# Altium schematic sheet BQ25570.SchDoc: LPEDT_Project_Schematic (part 2 of 3)
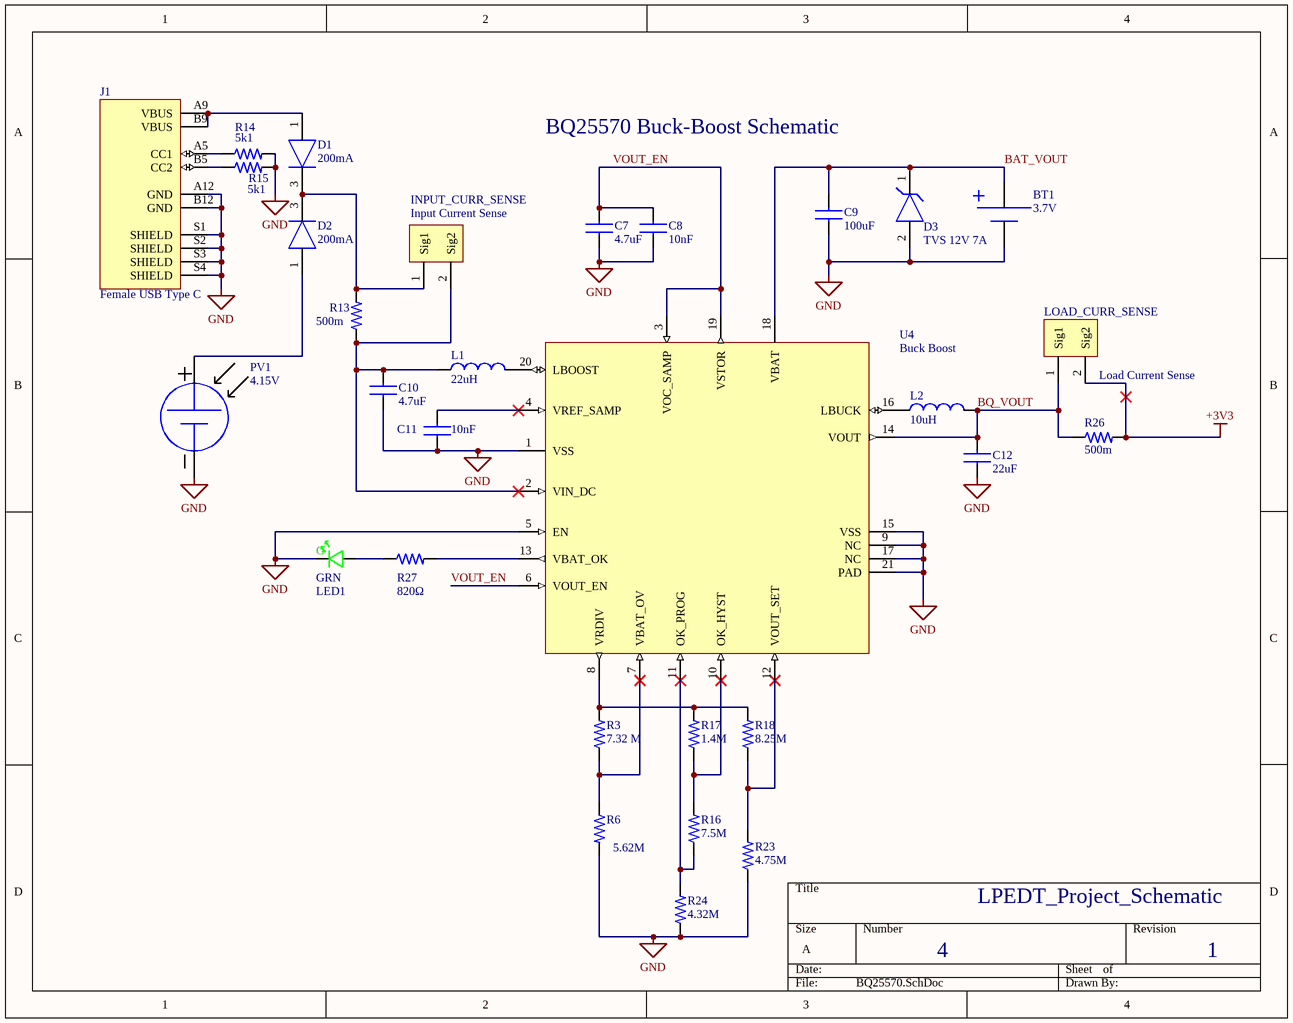
[diagram p1: BQ25570.SchDoc]
## Library data of the parts
BT1 = BT_CoinCell_25.4mm: BATTERY HOLDER COIN 24.5MM SMD; Manufacturer: Memory Protection Devices; Manufacturer Part Number: BU2450SM-JJ-GTR; Supplier: Digikey; Supplier Part Number: BU2450SM-JJ-GCT-ND; RoHS: Yes; Category: Uncategorized; Stock: 49410; Pricing: 1=1.72, 10=1.445, 50=1.2702, 100=1.1967 (USD); ComponentLink1URL: https://datasheet.ciiva.com/4/bu2450sm-jj-gtr-datasheet-4338.pdf?src-supplier=Digikey; ComponentLink1Description: https://datasheet.ciiva.com/4/bu2450sm-jj-gtr-datasheet-4338.pdf?src-supplier=Digikey; ComponentLink2URL: https://datasheet.ciiva.com/4/bu2450sm-jj-gtr-datasheet-4339.pdf?src-supplier=Digikey; ComponentLink2Description: https://datasheet.ciiva.com/4/bu2450sm-jj-gtr-datasheet-4339.pdf?src-supplier=Digikey; ComponentLink3URL: https://datasheet.ciiva.com/4/bu2450sm-jj-gtr-datasheet-4340.pdf?src-supplier=Digikey; ComponentLink3Description: https://datasheet.ciiva.com/4/bu2450sm-jj-gtr-datasheet-4340.pdf?src-supplier=Digikey
C7 C10 = C_4.7U_0603: CAP CER 4.7UF 10V X5R 0603; Manufacturer: Murata; Manufacturer Part Number: GRM188R61A475KAAJD; Dielectric Material: Ceramic; Multilayer: Yes; Tolerance  (fill in as +-): 10%; Supplier: Digikey; Supplier Part Number: 490-14373-1-ND; RoHS: Yes; Category: Ceramic Capacitors; Stock: 53982; Pricing: 1=0.38, 10=0.251, 50=0.185, 100=0.1506, 500=0.11888, 1000=0.10039 (USD); Mounting Technology: Surface Mount; Pins: 2; Package Shape: Rectangular; Case/Package: 0603; Terminal Finish: Nickel; Min Operating Temperature: -55°C; Max Operating Temperature: 85°C; JESD-609 Code: e3; Value: 4.7uF; Capacitor Type: Ceramic; Packaging: Tape and Reel; Tolerance (fill in as +-): 10%; Rated DC Voltage (URdc): 10V; Temperature Characteristics Code: X5R; Termination: Wraparound; Reach SVHC Compliant: Yes; RoHS Compliant: Yes; ComponentLink1URL: https://datasheet.ciiva.com:443/pdfs/VipMasterIC/IC/MURE/MURE-S-A0004349797/MURE-S-A0004352595-1.pdf?src-supplier=IHS+Markit; ComponentLink1Description: https://datasheet.ciiva.com:443/pdfs/VipMasterIC/IC/MURE/MURE-S-A0004349797/MURE-S-A0004352595-1.pdf?src-supplier=IHS+Markit; ComponentLink2URL: http://search.murata.co.jp/Ceramy/image/img/A01X/G101/ENG/GRM188R61A475KAAJ-01.pdf?src-supplier=Digikey; ComponentLink2Description: http://search.murata.co.jp/Ceramy/image/img/A01X/G101/ENG/GRM188R61A475KAAJ-01.pdf?src-supplier=Digikey
C8 C11 = C_10N_0603: Ceramic Capacitor, Multilayer, Ceramic, 100V, 10% +Tol, 10% -Tol, X7R, 15% TC, 0.01uF, Surface Mount, 0603; Manufacturer: Murata; Manufacturer Part Number: GCM188R72A103KA37D; Multilayer: Yes; Reference Standard: AEC-Q200; Supplier: Digikey; Supplier Part Number: 490-4781-6-ND; RoHS: Yes; Category: Ceramic Capacitors; Stock: 7901608; Pricing: 1=0.1, 10=0.038, 50=0.0218, 100=0.0168, 500=0.01268, 1000=0.00996 (USD); Mounting Technology: Surface Mount; Pins: 2; Dielectric Material: Ceramic; Package Shape: Rectangular; Case/Package: 0603; Terminal Finish: Nickel; Min Operating Temperature: -55°C; Max Operating Temperature: 125°C; JESD-609 Code: e3; Value: 10nF; Capacitor Type: Ceramic; Tolerance  (fill in as +-): 10%; Package Style: SMTMeter; Packaging: Tape and Reel; Tolerance (fill in as +-): 10%; Rated DC Voltage (URdc): 100V; Temperature Characteristics Code: X7R; Termination: Wraparound; Length: 1.6mm; Width: 0.8mm; Height: 0.9mm; Reach SVHC Compliant: Yes; RoHS Compliant: Yes; ComponentLink1URL: https://psearch.en.murata.com:443/capacitor/product/GCM188R72A103KA37%23.pdf?src-supplier=IHS+Markit; ComponentLink1Description: https://psearch.en.murata.com:443/capacitor/product/GCM188R72A103KA37%23.pdf?src-supplier=IHS+Markit; ComponentLink2URL: https://datasheet.ciiva.com/132/product-132908.pdf?src-supplier=Digikey; ComponentLink2Description: https://datasheet.ciiva.com/132/product-132908.pdf?src-supplier=Digikey; ComponentLink3URL: https://datasheet.ciiva.com/132/product-132907.pdf?src-supplier=Digikey; ComponentLink3Description: https://datasheet.ciiva.com/132/product-132907.pdf?src-supplier=Digikey; ComponentLink4URL: https://datasheet.ciiva.com/132/product-132909.pdf?src-supplier=Digikey; ComponentLink4Description: https://datasheet.ciiva.com/132/product-132909.pdf?src-supplier=Digikey; ComponentLink5URL: https://datasheet.ciiva.com/11786/0900766b80ef92d0-11786108.pdf?src-supplier=Rs; ComponentLink5Description: https://datasheet.ciiva.com/11786/0900766b80ef92d0-11786108.pdf?src-supplier=Rs; ComponentLink6URL: https://datasheet.ciiva.com/16497/product-16497251.pdf?src-supplier=Future+Electronics; ComponentLink6Description: https://datasheet.ciiva.com/16497/product-16497251.pdf?src-supplier=Future+Electronics; ComponentLink7URL: https://datasheet.ciiva.com/18183/getdatasheetpartid-178890-18183651.pdf?src-supplier=Verical; ComponentLink7Description: https://datasheet.ciiva.com/18183/getdatasheetpartid-178890-18183651.pdf?src-supplier=Verical; ComponentLink8URL: https://datasheet.ciiva.com/11619/product-11619719.pdf?src-supplier=Avnet; ComponentLink8Description: https://datasheet.ciiva.com/11619/product-11619719.pdf?src-supplier=Avnet
C9 = C_100U_0805: CAP CER 100UF 6.3V X5R 0805; Manufacturer: Murata; Manufacturer Part Number: GRM21BR60J107ME15L; Dielectric Material: Ceramic; Multilayer: Yes; Tolerance  (fill in as +-): 20%; Supplier: Digikey; Supplier Part Number: 490-13981-1-ND; RoHS: Yes; Category: Ceramic Capacitors; Stock: 216821; Pricing: 1=1.15, 10=0.863, 50=0.7874, 100=0.645, 500=0.5148, 1000=0.45423 (USD); Mounting Technology: Surface Mount; Pins: 2; Package Shape: Rectangular; Case/Package: 0805; Terminal Finish: Nickel; Min Operating Temperature: -55°C; Max Operating Temperature: 85°C; JESD-609 Code: e3; Value: 100uF; Capacitor Type: Ceramic; Packaging: Tape and Reel; Tolerance (fill in as +-): 20%; Rated DC Voltage (URdc): 6.3V; Temperature Characteristics Code: X5R; Termination: Wraparound; Reach SVHC Compliant: Yes; RoHS Compliant: Yes; ComponentLink1URL: https://datasheet.ciiva.com:443/pdfs/VipMasterIC/IC/MURE/MURE-S-A0004349797/MURE-S-A0004361963-1.pdf?src-supplier=IHS+Markit; ComponentLink1Description: https://datasheet.ciiva.com:443/pdfs/VipMasterIC/IC/MURE/MURE-S-A0004349797/MURE-S-A0004361963-1.pdf?src-supplier=IHS+Markit; ComponentLink2URL: http://www.farnell.com/datasheets/1957830.pdf?src-supplier=Farnell; ComponentLink2Description: http://www.farnell.com/datasheets/1957830.pdf?src-supplier=Farnell; ComponentLink3URL: https://datasheet.octopart.com/GRM21BR60J107ME15L-Murata-datasheet-48012791.pdf?src-supplier=Element14; ComponentLink3Description: https://datasheet.octopart.com/GRM21BR60J107ME15L-Murata-datasheet-48012791.pdf?src-supplier=Element14; ComponentLink4URL: http://www.farnell.com/datasheets/1957830.pdf?src-supplier=Element14; ComponentLink4Description: http://www.farnell.com/datasheets/1957830.pdf?src-supplier=Element14; ComponentLink5URL: https://search.murata.co.jp/Ceramy/image/img/A01X/G101/ENG/GRM21BR60J107ME15-01.pdf?src-supplier=Digikey; ComponentLink5Description: https://search.murata.co.jp/Ceramy/image/img/A01X/G101/ENG/GRM21BR60J107ME15-01.pdf?src-supplier=Digikey; ComponentLink6URL: https://datasheet.octopart.com/GRM21BR60J107ME15L-Murata-datasheet-62287462.pdf?src-supplier=Future+Electronics; ComponentLink6Description: https://datasheet.octopart.com/GRM21BR60J107ME15L-Murata-datasheet-62287462.pdf?src-supplier=Future+Electronics; ComponentLink7URL: http://www.farnell.com/datasheets/1957830.pdf?src-supplier=Newark; ComponentLink7Description: http://www.farnell.com/datasheets/1957830.pdf?src-supplier=Newark; ComponentLink8URL: https://datasheet.octopart.com/GRM21BR60J107ME15L-Murata-datasheet-165579666.pdf?src-supplier=TME; ComponentLink8Description: https://datasheet.octopart.com/GRM21BR60J107ME15L-Murata-datasheet-165579666.pdf?src-supplier=TME
C12 = C_22U_0603: CAP CER 22UF 10V X5R 0603; Manufacturer: Murata; Manufacturer Part Number: GRM188R61A226ME15D; Voltage Rating DC: 10 VDC; Tolerance: 20 %; Brand: Murata Electronics; Type: Voltage and Temperature Derating Recommended Product; Unit Weight: 0.000222 oz; Supplier 1: Digi-Key; Supplier Part Number 1: 490-10476-1-ND; Stock 1: 849458; Pricing 1: 1=0.33, 10=0.226, 50=0.1506, 100=0.1279, 500=0.0903, 1000=0.079 (USD); Product Category: Multilayer Ceramic Capacitors MLCC - SMD/SMT; RoHS: True; Capacitance: 22 uF; Dielectric: X5R; Case Code - in: 0603; Case Code - mm: 1608; Height: 0.8 mm; Maximum Operating Temperature: + 85 C; Minimum Operating Temperature: - 55 C; Product: General Type MLCCs; Series: GRM; Packaging: Reel; Length: 1.6 mm; Package / Case: 0603 (1608 metric); Factory Pack Quantity: 4000; Termination Style: SMD/SMT; Width: 0.8 mm; ComponentLink1URL: http://www.farnell.com/datasheets/2047978.pdf?src-supplier=Element14; ComponentLink1Description: http://www.farnell.com/datasheets/2047978.pdf?src-supplier=Element14
D1 D2 = D_200m: Rectifier Diode, Schottky, 1 Phase, 1 Element, 0.2A, 30V V(RRM), Silicon, TO-236; Manufacturer: ON Semiconductor; Manufacturer Part Number: BAT54LT1G; Package Body Material: Plastic; Forward Voltage: 1V; Number of Elements: 1; Max Power Dissipation: 200mW; Reverse Recovery Time-Max: 0.005us; Time @ Peak Reflow Temperature-Max (s): 40s; Qualification Status: Not Qualified; Supplier: Digikey; Supplier Part Number: BAT54LT1GOSCT-ND; RoHS: Yes; Category: Schottky Diodes; Stock: 189870; Pricing: 1=0.13, 10=0.095, 100=0.0511, 500=0.04014, 1000=0.02788 (USD); Pins: 3; Diode Element Material: SILICON; Package Shape: Rectangular; Terminal Finish: Tin; Min Operating Temperature: -55°C; Max Operating Temperature: 125°C; Diode Type: RECTIFIER; JESD-30 Code: R-PDSO-G3; Max Output current: 200mA; Package Style: SMALL OUTLINEMeter; Rep Pk Reverse Voltage-Max: 30V; Surface Mount: Yes; Technology: SCHOTTKY; Terminal Form: Gull Wing; Terminal Position: DUAL; JESD-609 Code: e3; Moisture Sensitivity Level: 1; Peak Reflow Temperature (Cel): 260°C; Reach SVHC Compliant: Yes; RoHS Compliant: Yes; JEDEC-95 Code: TO-236; ComponentLink1URL: https://datasheet.ciiva.com:443/pdfs/VipMasterIC/IC/ONSM/ONSM-S-A0005932371/ONSM-S-A0005932371-1.pdf?src-supplier=IHS+Markit; ComponentLink1Description: https://datasheet.ciiva.com:443/pdfs/VipMasterIC/IC/ONSM/ONSM-S-A0005932371/ONSM-S-A0005932371-1.pdf?src-supplier=IHS+Markit; ComponentLink2URL: https://datasheet.ciiva.com/7962/bat54lt1-d-7962967.pdf?src-supplier=Element14; ComponentLink2Description: https://datasheet.ciiva.com/7962/bat54lt1-d-7962967.pdf?src-supplier=Element14; ComponentLink3URL: https://datasheet.ciiva.com/8299/bat54lt1-d-8299649.pdf?src-supplier=Avnet; ComponentLink3Description: https://datasheet.ciiva.com/8299/bat54lt1-d-8299649.pdf?src-supplier=Avnet; ComponentLink4URL: https://datasheet.ciiva.com/1180/bat54lt1-d-1180300.pdf?src-supplier=Element14; ComponentLink4Description: https://datasheet.ciiva.com/1180/bat54lt1-d-1180300.pdf?src-supplier=Element14; ComponentLink5URL: https://datasheet.ciiva.com/1180/bat54lt1-d-1180299.pdf?src-supplier=Element14; ComponentLink5Description: https://datasheet.ciiva.com/1180/bat54lt1-d-1180299.pdf?src-supplier=Element14; ComponentLink6URL: https://datasheet.ciiva.com/28381/bat54lt1-d-28381274.pdf?src-supplier=Element14; ComponentLink6Description: https://datasheet.ciiva.com/28381/bat54lt1-d-28381274.pdf?src-supplier=Element14; ComponentLink7URL: https://datasheet.ciiva.com/14559/70099483-14559786.pdf?src-supplier=Allied+Electronics; ComponentLink7Description: https://datasheet.ciiva.com/14559/70099483-14559786.pdf?src-supplier=Allied+Electronics; ComponentLink8URL: https://datasheet.ciiva.com/8299/bat54lt1-d-8299979.pdf?src-supplier=Avnet; ComponentLink8Description: https://datasheet.ciiva.com/8299/bat54lt1-d-8299979.pdf?src-supplier=Avnet; ComponentLink9URL: https://datasheet.ciiva.com/16421/bat54lt1-d-16421631.pdf?src-supplier=Future+Electronics; ComponentLink9Description: https://datasheet.ciiva.com/16421/bat54lt1-d-16421631.pdf?src-supplier=Future+Electronics; ComponentLink10URL: https://datasheet.ciiva.com/915/bat54lt1-d-915396.pdf?src-supplier=Digikey; ComponentLink10Description: https://datasheet.ciiva.com/915/bat54lt1-d-915396.pdf?src-supplier=Digikey; ComponentLink11URL: https://datasheet.ciiva.com/915/bat54lt1-d-915397.pdf?src-supplier=Digikey; ComponentLink11Description: https://datasheet.ciiva.com/915/bat54lt1-d-915397.pdf?src-supplier=Digikey; ComponentLink12URL: https://datasheet.ciiva.com/915/bat54lt1-d-915395.pdf?src-supplier=Digikey; ComponentLink12Description: https://datasheet.ciiva.com/915/bat54lt1-d-915395.pdf?src-supplier=Digikey
D3 = D_TVS_7A: TVS DIODE 5VWM 12VC SOD723; Manufacturer: Littelfuse; Manufacturer Part Number: SP1003-01DTG; Direction: Unidirectional; Reverse Breakdown Voltage: 6V; Operating Supply Voltage: 5V; Value: 30pF; Number of Channels: 1; Power Line Protection: No; Polarity: Bidirectional,Unidirectional; Test Current: 1mA; Leakage Current: 100nA; Diode Type: ZENER; Clamping Voltage-Max: 12.5V; Supplier: Digikey; Supplier Part Number: F3377CT-ND; RoHS: Yes; Category: TVS Diodes; Stock: 109631; Pricing: 1=0.53, 10=0.41, 100=0.2459, 500=0.22772, 1000=0.15485, 2000=0.14255 (USD); Mounting Technology: Surface Mount; Pins: 2; Min Operating Temperature: -40°C; Max Operating Temperature: 85°C; Packaging: Tape and Reel; Package Quantity: 8000; Max Surge Current: 7A; Number of Unidirectional Channels: 1; Reverse Standoff Voltage: 5V; Min Breakdown Voltage: 6V; Clamping Voltage: 12V; Breakdown Voltage: 5V; Termination: SMD/SMT; Number of Elements: 1; Peak Pulse Current: 7A; Series: SP1003, SPA®; Reach SVHC Compliant: No; Lead Free: Lead Free; RoHS Compliant: Yes; ComponentLink1URL: https://datasheet.ciiva.com/8062/littelfuse-spa-sp1003-series-8062432.pdf?src-supplier=Element14; ComponentLink1Description: https://datasheet.ciiva.com/8062/littelfuse-spa-sp1003-series-8062432.pdf?src-supplier=Element14; ComponentLink2URL: https://datasheet.ciiva.com/5771/littelfuse-spa-sp1003-series-5771141.pdf?src-supplier=Farnell; ComponentLink2Description: https://datasheet.ciiva.com/5771/littelfuse-spa-sp1003-series-5771141.pdf?src-supplier=Farnell; ComponentLink3URL: https://datasheet.ciiva.com/330/littelfuse-tvs-diode-array-sp1003-datasheet-pdf-330691.pdf?src-supplier=Digikey; ComponentLink3Description: https://datasheet.ciiva.com/330/littelfuse-tvs-diode-array-sp1003-datasheet-pdf-330691.pdf?src-supplier=Digikey; ComponentLink4URL: https://datasheet.ciiva.com/330/littelfuse-tvs-diode-array-sp1003-datasheet-pdf-330692.pdf?src-supplier=Digikey; ComponentLink4Description: https://datasheet.ciiva.com/330/littelfuse-tvs-diode-array-sp1003-datasheet-pdf-330692.pdf?src-supplier=Digikey; ComponentLink5URL: https://datasheet.ciiva.com/330/littelfuse-tvs-diode-array-sp1003-datasheet-pdf-330693.pdf?src-supplier=Digikey; ComponentLink5Description: https://datasheet.ciiva.com/330/littelfuse-tvs-diode-array-sp1003-datasheet-pdf-330693.pdf?src-supplier=Digikey
INPUT_CURR_SENSE LOAD_CURR_SENSE = TP_2PIN_MALE: Board Connector, 2 Contact(s), 1 Row(s), Male, Straight, 0.1 inch Pitch, Solder Terminal, Locking, Black Insulator, Plug; Manufacturer: Wurth Electronics; Manufacturer Part Number: 61300211121; Option: General Purpose; Contact Pattern: RECTANGULAR; Contact Resistance: 20mR; Contact Style: SQ PIN-SKT; Dielectric Withstanding Voltage (AC): 500V; Filter Feature: No; Insulation Resistance: 1GR; Number Of Connectors: 1; Rated Current (Signal): 3A; Number of Contacts: 2; Body Length: 0.2inch; Reference Standard: UL; Reliability: COMMERCIAL; Supplier: Digikey; Supplier Part Number: 732-5315-ND; RoHS: Yes; Category: Headers and Wire Housings; Stock: 151065; Pricing: 1=0.13, 10=0.113, 25=0.094, 50=0.079, 100=0.071, 1000=0.065 (USD); Mounting Technology: Board; Contact Material: Copper Alloy; Contact Finish - Mating: GOLD; Contact Finish - Termination: Gold (Au) - with Nickel (Ni) barrier; Insulation Color: Black; Insulation Material: Polybutylene; Min Operating Temperature: -40°C; Max Operating Temperature: 125°C; Connector Type: BOARD CONNECTOR; JESD-609 Code: e4; Body/Shell Style: PLUG; Contact Gender: Male; Mixed Contacts: No; Mounting Style: STRAIGHT; Number of Rows Loaded: 1; PCB Contact Pattern: RECTANGULAR; Termination: Solder; Body Breadth: 0.1inch; Body Depth: 0.1inch; Mating Contact Pitch: 0.1inch; Mounting Option 1: LOCKING; Terminal Length: 0.118inch; Terminal Pitch: 2.54mm; Flammability Rating: UL94 V-0; Reach SVHC Compliant: Yes; RoHS Compliant: Yes; DIN Conformance: No; IEC Conformance: No; MIL Conformance: No; ComponentLink1URL: https://datasheet.ciiva.com:443/pdfs/VipMasterIC/IC/MIDC/MIDCS07676/MIDCS07676-1.pdf?src-supplier=IHS+Markit; ComponentLink1Description: https://datasheet.ciiva.com:443/pdfs/VipMasterIC/IC/MIDC/MIDCS07676/MIDCS07676-1.pdf?src-supplier=IHS+Markit; ComponentLink2URL: https://datasheet.ciiva.com/13619/6130xx11121-48870-13619345.pdf?src-supplier=Mouser; ComponentLink2Description: https://datasheet.ciiva.com/13619/6130xx11121-48870-13619345.pdf?src-supplier=Mouser
J1 = USB-C Power Connector: USB-C (USB TYPE-C) Receptacle Connector 24 (6+18 Dummy) Position Surface Mount, Right Angle; Through Hole; Manufacturer Part Number: USB4125-GF-A_REVA2; Package: None; Availability: Unavailable; Value: *; Price: None
L1 = L_22U_2828: General Purpose Inductor, 22uH, 20%, 1 Element, Ferrite-Core, SMD, 1111; Manufacturer: Wurth Electronics; Manufacturer Part Number: 744025220; Case/Size Code: 1111; DC Resistance (DCR): 575mR; Inductor Application: RF INDUCTOR; Channels: 1; Max Current Rating: 500mA; Self Resonant Frequency: 23MHz; Shape/Size Description: RECTANGULAR PACKAGE; Shielding: Unshielded; Test Frequency: 100kHz; Package Height: 2.8mm; Supplier: Digikey; Supplier Part Number: 732-2619-1-ND; RoHS: Yes; Category: Fixed Inductors; Stock: 9551; Pricing: 1=1.64, 10=1.578, 50=1.45, 100=1.205, 250=1.088 (USD); Pins: 2; Core Material: Ferrite; Terminal Finish: Copper; Min Operating Temperature: -40°C; Max Operating Temperature: 125°C; Tolerance: 20%; JESD-609 Code: e2; Construction: Chip; Inductance-Nom (L): 22uH; Inductor Type: GENERAL PURPOSE INDUCTOR; Package Style: SMTMeter; Packaging: Tape and Reel; Surface Mount: Yes; Terminal Placement: Dual Ended; Termination: Wraparound; Package Length: 2.8mm; Package Width: 2.8mm; Reach SVHC Compliant: Yes; RoHS Compliant: Yes; ComponentLink1URL: https://datasheet.ciiva.com:443/pdfs/VipMasterIC/IC/MIDC/MIDC-S-A0002801275/MIDC-S-A0002801275-1.pdf?src-supplier=IHS+Markit; ComponentLink1Description: https://datasheet.ciiva.com:443/pdfs/VipMasterIC/IC/MIDC/MIDC-S-A0002801275/MIDC-S-A0002801275-1.pdf?src-supplier=IHS+Markit; ComponentLink2URL: https://datasheet.ciiva.com/6697/744025220-6697526.pdf?src-supplier=Digikey; ComponentLink2Description: https://datasheet.ciiva.com/6697/744025220-6697526.pdf?src-supplier=Digikey; ComponentLink3URL: https://datasheet.ciiva.com/4954/744025220-66606-4954805.pdf?src-supplier=Mouser; ComponentLink3Description: https://datasheet.ciiva.com/4954/744025220-66606-4954805.pdf?src-supplier=Mouser; ComponentLink4URL: https://datasheet.ciiva.com/11803/0900766b80f886ba-11803595.pdf?src-supplier=Rs; ComponentLink4Description: https://datasheet.ciiva.com/11803/0900766b80f886ba-11803595.pdf?src-supplier=Rs; ComponentLink5URL: https://datasheet.ciiva.com/6697/744025220-6697527.pdf?src-supplier=Digikey; ComponentLink5Description: https://datasheet.ciiva.com/6697/744025220-6697527.pdf?src-supplier=Digikey; ComponentLink6URL: https://datasheet.ciiva.com/48691/001087107-da-01-ml-we-tpc-smd-speicherdrossel-7440252-de-en-48691031.pdf?src-supplier=Conrad; ComponentLink6Description: https://datasheet.ciiva.com/48691/001087107-da-01-ml-we-tpc-smd-speicherdrossel-7440252-de-en-48691031.pdf?src-supplier=Conrad
L2 = L_10U_2828: General Purpose Inductor, 10uH, 30%, 1 Element, Ferrite-Core, SMD, 1111; Manufacturer: Wurth Electronics; Manufacturer Part Number: 744029100; Channels: 1; Case/Size Code: 1111; DC Resistance (DCR): 470mR; Inductor Application: POWER INDUCTOR; Max Current Rating: 750mA; Self Resonant Frequency: 40MHz; Shape/Size Description: RECTANGULAR PACKAGE; Shielding: Unshielded; Test Frequency: 100kHz; Package Height: 1.35mm; Package Length: 2.8mm; Supplier: Digikey; Supplier Part Number: 732-1091-1-ND; RoHS: Yes; Category: Fixed Inductors; Stock: 33276; Pricing: 1=1.53, 10=1.481, 50=1.296, 100=1.222, 500=1.044 (USD); Pins: 2; Terminal Finish: Tin; Core Material: Ferrite; Min Operating Temperature: -40°C; Max Operating Temperature: 125°C; Tolerance: 30%; JESD-609 Code: e3; Package Style: SMTMeter; Surface Mount: Yes; Construction: Chip; Inductance-Nom (L): 10uH; Inductor Type: GENERAL PURPOSE INDUCTOR; Packaging: Tape and Reel; Terminal Placement: Dual Ended; Termination: One Surface; Package Width: 2.8mm; Reach SVHC Compliant: Yes; RoHS Compliant: Yes; ComponentLink1URL: https://datasheet.ciiva.com:443/pdfs/VipMasterIC/IC/MIDC/MIDC-S-A0002801410/MIDC-S-A0002801335-1.pdf?src-supplier=IHS+Markit; ComponentLink1Description: https://datasheet.ciiva.com:443/pdfs/VipMasterIC/IC/MIDC/MIDC-S-A0002801410/MIDC-S-A0002801335-1.pdf?src-supplier=IHS+Markit; ComponentLink2URL: https://datasheet.ciiva.com/6700/744029100-6700264.pdf?src-supplier=Digikey; ComponentLink2Description: https://datasheet.ciiva.com/6700/744029100-6700264.pdf?src-supplier=Digikey; ComponentLink3URL: https://datasheet.ciiva.com/5975/69360-5975061.pdf?src-supplier=Farnell; ComponentLink3Description: https://datasheet.ciiva.com/5975/69360-5975061.pdf?src-supplier=Farnell; ComponentLink4URL: https://datasheet.ciiva.com/4961/744029100-81254-4961409.pdf?src-supplier=Mouser; ComponentLink4Description: https://datasheet.ciiva.com/4961/744029100-81254-4961409.pdf?src-supplier=Mouser; ComponentLink5URL: https://datasheet.ciiva.com/11802/0900766b80d7f1cc-11802020.pdf?src-supplier=Rs; ComponentLink5Description: https://datasheet.ciiva.com/11802/0900766b80d7f1cc-11802020.pdf?src-supplier=Rs; ComponentLink6URL: https://datasheet.ciiva.com/6700/744029100-6700266.pdf?src-supplier=Digikey; ComponentLink6Description: https://datasheet.ciiva.com/6700/744029100-6700266.pdf?src-supplier=Digikey; ComponentLink7URL: https://datasheet.ciiva.com/7892/69360-7892549.pdf?src-supplier=Element14; ComponentLink7Description: https://datasheet.ciiva.com/7892/69360-7892549.pdf?src-supplier=Element14; ComponentLink8URL: https://datasheet.ciiva.com/22702/69360-22702631.pdf?src-supplier=Element14; ComponentLink8Description: https://datasheet.ciiva.com/22702/69360-22702631.pdf?src-supplier=Element14
LED1 = LED_GREEN_0603: LED, 0603, GREEN, 430MCD, 520NM; Manufacturer: Wurth Electronics; Manufacturer Part Number: 150060GS75000; Dynamic Catalog: 0603 Rectangle with Flat Top Chip LEDs; 3D Model: SMCW_0603.igs / SMCW_0603.stp / SMCW_0603.wrl; Wavelength - Peak: 515nm; Voltage - Forward (Vf) (Typ): 3.2V; Current - Test: 20mA; Viewing Angle: 140°; Lens Type: Clear; Lens Style/Size: Rectangle with Flat Top, 1.1mm x 0.7mm; Other Names: 732-4971-2; Supplier 1: Digi-Key; Stock 1: 34964; Pricing 1: 1=0.14, 50=0.129, 100=0.11, 500=0.095 (USD); Standard Package: 4,000; Category: Optoelectronics; Family: LED Indication - Discrete; Series: WL-SMCW; Packaging: Tape & Reel (TR); Color: Green; Wavelength - Dominant: 520nm; Millicandela Rating: 430mcd; Package / Case: 0603 (1608 Metric); Size / Dimension: 1.60mm L x 0.80mm W; Height: 0.70mm; Mounting Type: Surface Mount; Online Catalog: 0603 Rectangle with Flat Top Chip LEDs; ComponentLink1URL: https://katalog.we-online.de/led/datasheet/150060GS75000.pdf?src-supplier=Digi-Key; ComponentLink1Description: https://katalog.we-online.de/led/datasheet/150060GS75000.pdf?src-supplier=Digi-Key; ComponentLink2URL: http://www.produktinfo.conrad.com/datenblaetter/750000-774999/759427-da-01-en-CHIPLED_0603_W_KL_GRUEN_150060GS75000.pdf?src-supplier=Conrad; ComponentLink2Description: http://www.produktinfo.conrad.com/datenblaetter/750000-774999/759427-da-01-en-CHIPLED_0603_W_KL_GRUEN_150060GS75000.pdf?src-supplier=Conrad; Supplier Part Number 1: 732-4971-1-ND
PV1 = PV_4.15V: Monocryst Solar Cell 184MW 4.15V; Manufacturer: ANYSOLAR; Manufacturer Part Number: SM141K06L; Supplier: Digikey; Supplier Part Number: SM141K06L-ND; RoHS: No; Category: Uncategorized; Stock: 2333; Pricing: 1=6.3, 25=4.9996, 50=4.7572, 100=4.545, 250=4.242, 500=4.0299 (USD)
R3 = R_7M32_0603: Fixed Resistor, Metal Glaze/thick Film, 0.1W, 7320000ohm, 75V, 1% +/-Tol, 100ppm/Cel, Surface Mount, 0603; Manufacturer: Vishay; Manufacturer Part Number: CRCW06037M32FKEA; Power: 100mW; Rated Temperature: 70°C; Value: 7.32MR; Temperature Coefficient: 100ppm/°C; Package Height: 0.45mm; Package Length: 1.55mm; Package Width: 0.85mm; Reference Standard: AEC-Q200; Supplier: Digikey; Supplier Part Number: 541-7.32MHCT-ND; RoHS: Yes; Category: Chip SMD Resistors; Stock: 19410; Pricing: 1=0.1, 10=0.026, 50=0.0166, 100=0.014, 500=0.00954, 1000=0.00824 (USD); Mounting Technology: Surface Mount; Pins: 2; Package Shape: Rectangular; Case/Package: 0603; Terminal Finish: Nickel; Min Operating Temperature: -55°C; Max Operating Temperature: 155°C; Tolerance: 1%; JESD-609 Code: e3; Resistor Type: FIXED RESISTOR; Construction: Chip; Package Style: SMTMeter; Packaging: Tape and Reel; Technology: METAL GLAZE/THICK FILM; Termination: Wraparound; Working Voltage: 75V; Reach SVHC Compliant: Yes; RoHS Compliant: Yes; ComponentLink1URL: https://datasheet.ciiva.com:443/pdfs/VipMasterIC/IC/VISH/VISH-S-A0007266705/VISH-S-A0007266705-1.pdf?src-supplier=IHS+Markit; ComponentLink1Description: https://datasheet.ciiva.com:443/pdfs/VipMasterIC/IC/VISH/VISH-S-A0007266705/VISH-S-A0007266705-1.pdf?src-supplier=IHS+Markit; ComponentLink2URL: https://datasheet.ciiva.com/5588/dcrcwe3-109170-5588998.pdf?src-supplier=Mouser; ComponentLink2Description: https://datasheet.ciiva.com/5588/dcrcwe3-109170-5588998.pdf?src-supplier=Mouser; ComponentLink3URL: https://datasheet.ciiva.com/22676/1700796-22676479.pdf?src-supplier=Element14; ComponentLink3Description: https://datasheet.ciiva.com/22676/1700796-22676479.pdf?src-supplier=Element14; ComponentLink4URL: https://datasheet.ciiva.com/2525/dcrcwe3-2525464.pdf?src-supplier=Digikey; ComponentLink4Description: https://datasheet.ciiva.com/2525/dcrcwe3-2525464.pdf?src-supplier=Digikey; ComponentLink5URL: https://datasheet.ciiva.com/2525/dcrcwe3-2525465.pdf?src-supplier=Digikey; ComponentLink5Description: https://datasheet.ciiva.com/2525/dcrcwe3-2525465.pdf?src-supplier=Digikey; ComponentLink6URL: https://datasheet.ciiva.com/2525/dcrcwe3-2525466.pdf?src-supplier=Digikey; ComponentLink6Description: https://datasheet.ciiva.com/2525/dcrcwe3-2525466.pdf?src-supplier=Digikey
R6 = R_5M62_0603: Fixed Resistor, Metal Glaze/thick Film, 0.1W, 5620000ohm, 75V, 1% +/-Tol, 100ppm/Cel, Surface Mount, 0603; Manufacturer: Vishay; Manufacturer Part Number: CRCW06035M62FKEA; Power: 100mW; Rated Temperature: 70°C; Value: 5.62MR; Temperature Coefficient: 100ppm/°C; Package Height: 0.45mm; Package Length: 1.55mm; Package Width: 0.85mm; Reference Standard: AEC-Q200; Supplier: Digikey; Supplier Part Number: 541-5.62MHCT-ND; RoHS: Yes; Category: Chip SMD Resistors; Stock: 27479; Pricing: 1=0.1, 10=0.026, 50=0.0166, 100=0.0139, 500=0.0095, 1000=0.00821 (USD); Mounting Technology: Surface Mount; Pins: 2; Package Shape: Rectangular; Case/Package: 0603; Terminal Finish: Nickel; Min Operating Temperature: -55°C; Max Operating Temperature: 155°C; Tolerance: 1%; JESD-609 Code: e3; Resistor Type: FIXED RESISTOR; Construction: Chip; Package Style: SMTMeter; Packaging: Tape and Reel; Technology: METAL GLAZE/THICK FILM; Termination: Wraparound; Working Voltage: 75V; Reach SVHC Compliant: Yes; RoHS Compliant: Yes; ComponentLink1URL: https://datasheet.ciiva.com:443/pdfs/VipMasterIC/IC/VISH/VISH-S-A0007266705/VISH-S-A0007266705-1.pdf?src-supplier=IHS+Markit; ComponentLink1Description: https://datasheet.ciiva.com:443/pdfs/VipMasterIC/IC/VISH/VISH-S-A0007266705/VISH-S-A0007266705-1.pdf?src-supplier=IHS+Markit; ComponentLink2URL: https://datasheet.ciiva.com/7748/1697337-7748679.pdf?src-supplier=Element14; ComponentLink2Description: https://datasheet.ciiva.com/7748/1697337-7748679.pdf?src-supplier=Element14; ComponentLink3URL: https://datasheet.ciiva.com/7748/1697337-7748680.pdf?src-supplier=Element14; ComponentLink3Description: https://datasheet.ciiva.com/7748/1697337-7748680.pdf?src-supplier=Element14; ComponentLink4URL: https://datasheet.ciiva.com/22675/1700796-22675468.pdf?src-supplier=Element14; ComponentLink4Description: https://datasheet.ciiva.com/22675/1700796-22675468.pdf?src-supplier=Element14; ComponentLink5URL: https://datasheet.ciiva.com/22675/1700796-22675469.pdf?src-supplier=Element14; ComponentLink5Description: https://datasheet.ciiva.com/22675/1700796-22675469.pdf?src-supplier=Element14; ComponentLink6URL: https://datasheet.ciiva.com/22700/1697337-22700634.pdf?src-supplier=Element14; ComponentLink6Description: https://datasheet.ciiva.com/22700/1697337-22700634.pdf?src-supplier=Element14; ComponentLink7URL: https://datasheet.ciiva.com/5546/dcrcwe3-109170-5546746.pdf?src-supplier=Mouser; ComponentLink7Description: https://datasheet.ciiva.com/5546/dcrcwe3-109170-5546746.pdf?src-supplier=Mouser; ComponentLink8URL: https://datasheet.ciiva.com/9065/dcrcwe3-9065258.pdf?src-supplier=Avnet; ComponentLink8Description: https://datasheet.ciiva.com/9065/dcrcwe3-9065258.pdf?src-supplier=Avnet; ComponentLink9URL: https://datasheet.ciiva.com/2525/dcrcwe3-2525255.pdf?src-supplier=Digikey; ComponentLink9Description: https://datasheet.ciiva.com/2525/dcrcwe3-2525255.pdf?src-supplier=Digikey; ComponentLink10URL: https://datasheet.ciiva.com/2525/dcrcwe3-2525256.pdf?src-supplier=Digikey; ComponentLink10Description: https://datasheet.ciiva.com/2525/dcrcwe3-2525256.pdf?src-supplier=Digikey; ComponentLink11URL: https://datasheet.ciiva.com/2525/dcrcwe3-2525254.pdf?src-supplier=Digikey; ComponentLink11Description: https://datasheet.ciiva.com/2525/dcrcwe3-2525254.pdf?src-supplier=Digikey
R13 R26 = R_500m_0603: Fixed Resistor, Metal Glaze/thick Film, 0.1W, 0.5ohm, 5% +/-Tol, 800ppm/Cel, Surface Mount, 0603; Manufacturer: Yageo; Manufacturer Part Number: RL0603JR-070R5L; Additional Feature: LASER TRIMMABLE; Power: 100mW; Rated Temperature: 70°C; Value: 500mR; Temperature Coefficient: 800ppm/°C; Package Height: 0.45mm; Package Length: 1.6mm; Package Width: 0.8mm; Supplier: Digikey; Supplier Part Number: 13-RL0603JR-070R5LCT-ND; RoHS: Yes; Category: Chip SMD Resistors; Stock: 16696; Pricing: 1=0.24, 10=0.121, 50=0.0812, 100=0.0692, 500=0.04966, 1000=0.04371 (USD); Mounting Technology: Surface Mount; Pins: 2; Package Shape: Rectangular; Case/Package: 0603; Terminal Finish: Nickel; Min Operating Temperature: -55°C; Max Operating Temperature: 125°C; Tolerance: 5%; JESD-609 Code: e3; Resistor Type: FIXED RESISTOR; Construction: Chip; Package Style: SMTMeter; Packaging: Tape and Reel; Series: RL; Technology: METAL GLAZE/THICK FILM; Termination: Wraparound; Reach SVHC Compliant: Yes; RoHS Compliant: Yes; ComponentLink1URL: https://datasheet.ciiva.com:443/pdfs/VipMasterIC/IC/YAGO/YAGO-S-A0001508779/YAGO-S-A0001508779-1.pdf?src-supplier=IHS+Markit; ComponentLink1Description: https://datasheet.ciiva.com:443/pdfs/VipMasterIC/IC/YAGO/YAGO-S-A0001508779/YAGO-S-A0001508779-1.pdf?src-supplier=IHS+Markit; ComponentLink2URL: http://www.mouser.com/ds/2/447/PYu-RL_521_RoHS_L_5-2927.pdf?src-supplier=Mouser; ComponentLink2Description: http://www.mouser.com/ds/2/447/PYu-RL_521_RoHS_L_5-2927.pdf?src-supplier=Mouser; ComponentLink3URL: http://www.yageo.com/documents/recent/PYu-RL_Group_521_RoHS_L_2.pdf?src-supplier=Digikey; ComponentLink3Description: http://www.yageo.com/documents/recent/PYu-RL_Group_521_RoHS_L_2.pdf?src-supplier=Digikey
R14 R15 = R_5K1_0603: Fixed Resistor, Metal Glaze/thick Film, 0.1W, 5100ohm, 75V, 1% +/-Tol, 100ppm/Cel, Surface Mount, 0603; Manufacturer: Yageo; Manufacturer Part Number: RC0603FR-075K1L; Additional Feature: LASER TRIMMABLE; Power: 100mW; Rated Temperature: 70°C; Value: 5.1kR; Temperature Coefficient: 100ppm/°C; Package Height: 0.45mm; Package Length: 1.6mm; Package Width: 0.8mm; Supplier: Digikey; Supplier Part Number: 311-5.10KHRCT-ND; RoHS: Yes; Category: Chip SMD Resistors; Stock: 2600731; Pricing: 1=0.1, 10=0.019, 50=0.0112, 100=0.0093, 500=0.00622, 1000=0.00532 (USD); Mounting Technology: Surface Mount; Pins: 2; Package Shape: Rectangular; Case/Package: 0603; Terminal Finish: Nickel; Min Operating Temperature: -55°C; Max Operating Temperature: 155°C; Tolerance: 1%; JESD-609 Code: e3; Resistor Type: FIXED RESISTOR; Construction: Chip; Package Style: SMTMeter; Packaging: Tape and Reel; Technology: METAL GLAZE/THICK FILM; Termination: Wraparound; Working Voltage: 75V; Reach SVHC Compliant: Yes; RoHS Compliant: Yes; ComponentLink1URL: https://datasheet.ciiva.com:443/pdfs/VipMasterIC/IC/YAGO/YAGO-S-A0008145938/YAGO-S-A0008145938-1.pdf?src-supplier=IHS+Markit; ComponentLink1Description: https://datasheet.ciiva.com:443/pdfs/VipMasterIC/IC/YAGO/YAGO-S-A0008145938/YAGO-S-A0008145938-1.pdf?src-supplier=IHS+Markit; ComponentLink2URL: https://datasheet.ciiva.com/46395/443971-46395016.pdf?src-supplier=Element14; ComponentLink2Description: https://datasheet.ciiva.com/46395/443971-46395016.pdf?src-supplier=Element14; ComponentLink3URL: https://datasheet.ciiva.com/2454/pyu-r-int-thick-7-2454046.pdf?src-supplier=Digikey; ComponentLink3Description: https://datasheet.ciiva.com/2454/pyu-r-int-thick-7-2454046.pdf?src-supplier=Digikey; ComponentLink4URL: https://datasheet.ciiva.com/2454/pyu-r-int-thick-7-2454047.pdf?src-supplier=Digikey; ComponentLink4Description: https://datasheet.ciiva.com/2454/pyu-r-int-thick-7-2454047.pdf?src-supplier=Digikey; ComponentLink5URL: https://datasheet.ciiva.com/2454/pyu-r-int-thick-7-2454045.pdf?src-supplier=Digikey; ComponentLink5Description: https://datasheet.ciiva.com/2454/pyu-r-int-thick-7-2454045.pdf?src-supplier=Digikey; ComponentLink6URL: https://datasheet.ciiva.com/15189/getdatasheetpartid-326732-15189786.pdf?src-supplier=Verical; ComponentLink6Description: https://datasheet.ciiva.com/15189/getdatasheetpartid-326732-15189786.pdf?src-supplier=Verical
R16 = R_7M5_0603: Fixed Resistor, Metal Glaze/thick Film, 0.1W, 7500000ohm, 75V, 1% +/-Tol, 100ppm/Cel, Surface Mount, 0603; Manufacturer: Vishay; Manufacturer Part Number: CRCW06037M50FKEA; Power: 100mW; Rated Temperature: 70°C; Value: 7.5MR; Temperature Coefficient: 100ppm/°C; Package Height: 0.45mm; Package Length: 1.55mm; Package Width: 0.85mm; Reference Standard: AEC-Q200; Supplier: Digikey; Supplier Part Number: 541-7.50MHCT-ND; RoHS: Yes; Category: Chip SMD Resistors; Stock: 46560; Pricing: 1=0.1, 10=0.026, 50=0.0166, 100=0.014, 500=0.00954, 1000=0.00824 (USD); Mounting Technology: Surface Mount; Pins: 2; Package Shape: Rectangular; Case/Package: 0603; Terminal Finish: Nickel; Min Operating Temperature: -55°C; Max Operating Temperature: 155°C; Tolerance: 1%; JESD-609 Code: e3; Resistor Type: FIXED RESISTOR; Construction: Chip; Package Style: SMTMeter; Packaging: Tape and Reel; Technology: METAL GLAZE/THICK FILM; Termination: Wraparound; Working Voltage: 75V; Reach SVHC Compliant: Yes; RoHS Compliant: Yes; ComponentLink1URL: https://datasheet.ciiva.com:443/pdfs/VipMasterIC/IC/VISH/VISH-S-A0007266705/VISH-S-A0007266705-1.pdf?src-supplier=IHS+Markit; ComponentLink1Description: https://datasheet.ciiva.com:443/pdfs/VipMasterIC/IC/VISH/VISH-S-A0007266705/VISH-S-A0007266705-1.pdf?src-supplier=IHS+Markit; ComponentLink2URL: https://datasheet.ciiva.com/5552/dcrcwe3-109170-5552646.pdf?src-supplier=Mouser; ComponentLink2Description: https://datasheet.ciiva.com/5552/dcrcwe3-109170-5552646.pdf?src-supplier=Mouser; ComponentLink3URL: https://datasheet.ciiva.com/22704/1697337-22704015.pdf?src-supplier=Element14; ComponentLink3Description: https://datasheet.ciiva.com/22704/1697337-22704015.pdf?src-supplier=Element14; ComponentLink4URL: https://datasheet.ciiva.com/16784/70201119-16784828.pdf?src-supplier=Allied+Electronics; ComponentLink4Description: https://datasheet.ciiva.com/16784/70201119-16784828.pdf?src-supplier=Allied+Electronics; ComponentLink5URL: https://datasheet.ciiva.com/22869/70201119-22869559.pdf?src-supplier=Allied+Electronics; ComponentLink5Description: https://datasheet.ciiva.com/22869/70201119-22869559.pdf?src-supplier=Allied+Electronics; ComponentLink6URL: https://datasheet.ciiva.com/2494/dcrcwe3-2494735.pdf?src-supplier=Digikey; ComponentLink6Description: https://datasheet.ciiva.com/2494/dcrcwe3-2494735.pdf?src-supplier=Digikey; ComponentLink7URL: https://datasheet.ciiva.com/2494/dcrcwe3-2494736.pdf?src-supplier=Digikey; ComponentLink7Description: https://datasheet.ciiva.com/2494/dcrcwe3-2494736.pdf?src-supplier=Digikey; ComponentLink8URL: https://datasheet.ciiva.com/2494/dcrcwe3-2494737.pdf?src-supplier=Digikey; ComponentLink8Description: https://datasheet.ciiva.com/2494/dcrcwe3-2494737.pdf?src-supplier=Digikey
R17 = R_1M4_0603: Fixed Resistor, Metal Glaze/thick Film, 0.1W, 1400000ohm, 75V, 1% +/-Tol, 100ppm/Cel, Surface Mount, 0603; Manufacturer: Vishay; Manufacturer Part Number: CRCW06031M40FKEA; Power: 100mW; Rated Temperature: 70°C; Value: 1.4MR; Temperature Coefficient: 100ppm/°C; Package Height: 0.45mm; Package Length: 1.55mm; Package Width: 0.85mm; Reference Standard: AEC-Q200; Supplier: Digikey; Supplier Part Number: 541-1.40MHCT-ND; RoHS: Yes; Category: Chip SMD Resistors; Stock: 34954; Pricing: 1=0.1, 10=0.026, 50=0.0166, 100=0.014, 500=0.00954, 1000=0.00824 (USD); Mounting Technology: Surface Mount; Pins: 2; Package Shape: Rectangular; Case/Package: 0603; Terminal Finish: Nickel; Min Operating Temperature: -55°C; Max Operating Temperature: 155°C; Tolerance: 1%; JESD-609 Code: e3; Resistor Type: FIXED RESISTOR; Construction: Chip; Package Style: SMTMeter; Packaging: Tape and Reel; Technology: METAL GLAZE/THICK FILM; Termination: Wraparound; Working Voltage: 75V; Reach SVHC Compliant: Yes; RoHS Compliant: Yes; ComponentLink1URL: https://datasheet.ciiva.com:443/pdfs/VipMasterIC/IC/VISH/VISH-S-A0007266705/VISH-S-A0007266705-1.pdf?src-supplier=IHS+Markit; ComponentLink1Description: https://datasheet.ciiva.com:443/pdfs/VipMasterIC/IC/VISH/VISH-S-A0007266705/VISH-S-A0007266705-1.pdf?src-supplier=IHS+Markit; ComponentLink2URL: https://datasheet.ciiva.com/22702/1697337-22702714.pdf?src-supplier=Element14; ComponentLink2Description: https://datasheet.ciiva.com/22702/1697337-22702714.pdf?src-supplier=Element14; ComponentLink3URL: https://datasheet.ciiva.com/7670/1697337-7670542.pdf?src-supplier=Element14; ComponentLink3Description: https://datasheet.ciiva.com/7670/1697337-7670542.pdf?src-supplier=Element14; ComponentLink4URL: https://datasheet.ciiva.com/7670/1697337-7670543.pdf?src-supplier=Element14; ComponentLink4Description: https://datasheet.ciiva.com/7670/1697337-7670543.pdf?src-supplier=Element14; ComponentLink5URL: https://datasheet.ciiva.com/16215/dcrcwe3-16215401.pdf?src-supplier=Future+Electronics; ComponentLink5Description: https://datasheet.ciiva.com/16215/dcrcwe3-16215401.pdf?src-supplier=Future+Electronics; ComponentLink6URL: https://datasheet.ciiva.com/22870/70201119-22870815.pdf?src-supplier=Allied+Electronics; ComponentLink6Description: https://datasheet.ciiva.com/22870/70201119-22870815.pdf?src-supplier=Allied+Electronics; ComponentLink7URL: https://datasheet.ciiva.com/5541/dcrcwe3-109170-5541158.pdf?src-supplier=Mouser; ComponentLink7Description: https://datasheet.ciiva.com/5541/dcrcwe3-109170-5541158.pdf?src-supplier=Mouser; ComponentLink8URL: https://datasheet.ciiva.com/16785/70201119-16785253.pdf?src-supplier=Allied+Electronics; ComponentLink8Description: https://datasheet.ciiva.com/16785/70201119-16785253.pdf?src-supplier=Allied+Electronics; ComponentLink9URL: https://datasheet.ciiva.com/9102/dcrcwe3-9102326.pdf?src-supplier=Avnet; ComponentLink9Description: https://datasheet.ciiva.com/9102/dcrcwe3-9102326.pdf?src-supplier=Avnet; ComponentLink10URL: https://datasheet.ciiva.com/2466/dcrcwe3-2466344.pdf?src-supplier=Digikey; ComponentLink10Description: https://datasheet.ciiva.com/2466/dcrcwe3-2466344.pdf?src-supplier=Digikey; ComponentLink11URL: https://datasheet.ciiva.com/2466/dcrcwe3-2466345.pdf?src-supplier=Digikey; ComponentLink11Description: https://datasheet.ciiva.com/2466/dcrcwe3-2466345.pdf?src-supplier=Digikey; ComponentLink12URL: https://datasheet.ciiva.com/2466/dcrcwe3-2466346.pdf?src-supplier=Digikey; ComponentLink12Description: https://datasheet.ciiva.com/2466/dcrcwe3-2466346.pdf?src-supplier=Digikey
R18 = R_8M25_0603: Fixed Resistor, Metal Glaze/thick Film, 0.1W, 8250000ohm, 75V, 1% +/-Tol, 100ppm/Cel, Surface Mount, 0603; Manufacturer: Vishay; Manufacturer Part Number: CRCW06038M25FKEA; Power: 100mW; Rated Temperature: 70°C; Value: 8.25MR; Temperature Coefficient: 100ppm/°C; Package Height: 0.45mm; Package Length: 1.55mm; Package Width: 0.85mm; Reference Standard: AEC-Q200; Supplier: Digikey; Supplier Part Number: 541-8.25MHCT-ND; RoHS: Yes; Category: Chip SMD Resistors; Stock: 15579; Pricing: 1=0.1, 10=0.026, 50=0.0166, 100=0.0139, 500=0.0095, 1000=0.00821 (USD); Mounting Technology: Surface Mount; Pins: 2; Package Shape: Rectangular; Case/Package: 0603; Terminal Finish: Nickel; Min Operating Temperature: -55°C; Max Operating Temperature: 155°C; Tolerance: 1%; JESD-609 Code: e3; Resistor Type: FIXED RESISTOR; Construction: Chip; Package Style: SMTMeter; Packaging: Tape and Reel; Technology: METAL GLAZE/THICK FILM; Termination: Wraparound; Working Voltage: 75V; Reach SVHC Compliant: Yes; RoHS Compliant: Yes; ComponentLink1URL: https://datasheet.ciiva.com:443/pdfs/VipMasterIC/IC/VISH/VISH-S-A0007266705/VISH-S-A0007266705-1.pdf?src-supplier=IHS+Markit; ComponentLink1Description: https://datasheet.ciiva.com:443/pdfs/VipMasterIC/IC/VISH/VISH-S-A0007266705/VISH-S-A0007266705-1.pdf?src-supplier=IHS+Markit; ComponentLink2URL: https://datasheet.ciiva.com/7748/1697337-7748717.pdf?src-supplier=Element14; ComponentLink2Description: https://datasheet.ciiva.com/7748/1697337-7748717.pdf?src-supplier=Element14; ComponentLink3URL: https://datasheet.ciiva.com/7748/1697337-7748718.pdf?src-supplier=Element14; ComponentLink3Description: https://datasheet.ciiva.com/7748/1697337-7748718.pdf?src-supplier=Element14; ComponentLink4URL: https://datasheet.ciiva.com/2513/dcrcwe3-2513731.pdf?src-supplier=Digikey; ComponentLink4Description: https://datasheet.ciiva.com/2513/dcrcwe3-2513731.pdf?src-supplier=Digikey; ComponentLink5URL: https://datasheet.ciiva.com/2513/dcrcwe3-2513732.pdf?src-supplier=Digikey; ComponentLink5Description: https://datasheet.ciiva.com/2513/dcrcwe3-2513732.pdf?src-supplier=Digikey; ComponentLink6URL: https://datasheet.ciiva.com/2513/dcrcwe3-2513733.pdf?src-supplier=Digikey; ComponentLink6Description: https://datasheet.ciiva.com/2513/dcrcwe3-2513733.pdf?src-supplier=Digikey
R23 = R_4M75_0603: Fixed Resistor, Metal Glaze/thick Film, 0.1W, 4750000ohm, 75V, 1% +/-Tol, 100ppm/Cel, Surface Mount, 0603; Manufacturer: Yageo; Manufacturer Part Number: RC0603FR-074M75L; Additional Feature: LASER TRIMMABLE; Power: 100mW; Rated Temperature: 70°C; Value: 4.75MR; Temperature Coefficient: 100ppm/°C; Package Height: 0.45mm; Package Length: 1.6mm; Package Width: 0.8mm; Supplier: Digikey; Supplier Part Number: 311-4.75MHRCT-ND; RoHS: Yes; Category: Chip SMD Resistors; Stock: 167970; Pricing: 1=0.1, 10=0.019, 50=0.0112, 100=0.0093, 500=0.00622, 1000=0.00532 (USD); Mounting Technology: Surface Mount; Pins: 2; Package Shape: Rectangular; Case/Package: 0603; Terminal Finish: Nickel; Min Operating Temperature: -55°C; Max Operating Temperature: 155°C; Tolerance: 1%; JESD-609 Code: e3; Resistor Type: FIXED RESISTOR; Construction: Chip; Package Style: SMTMeter; Packaging: Tape and Reel; Technology: METAL GLAZE/THICK FILM; Termination: Wraparound; Working Voltage: 75V; Reach SVHC Compliant: Yes; RoHS Compliant: Yes; ComponentLink1URL: https://datasheet.ciiva.com:443/pdfs/VipMasterIC/IC/YAGO/YAGO-S-A0008145938/YAGO-S-A0008145938-1.pdf?src-supplier=IHS+Markit; ComponentLink1Description: https://datasheet.ciiva.com:443/pdfs/VipMasterIC/IC/YAGO/YAGO-S-A0008145938/YAGO-S-A0008145938-1.pdf?src-supplier=IHS+Markit; ComponentLink2URL: https://datasheet.ciiva.com/2455/pyu-r-int-thick-7-2455038.pdf?src-supplier=Digikey; ComponentLink2Description: https://datasheet.ciiva.com/2455/pyu-r-int-thick-7-2455038.pdf?src-supplier=Digikey; ComponentLink3URL: https://datasheet.ciiva.com/2455/pyu-r-int-thick-7-2455039.pdf?src-supplier=Digikey; ComponentLink3Description: https://datasheet.ciiva.com/2455/pyu-r-int-thick-7-2455039.pdf?src-supplier=Digikey; ComponentLink4URL: https://datasheet.ciiva.com/2455/pyu-r-int-thick-7-2455040.pdf?src-supplier=Digikey; ComponentLink4Description: https://datasheet.ciiva.com/2455/pyu-r-int-thick-7-2455040.pdf?src-supplier=Digikey
R24 = R_4M32_0603: Fixed Resistor, Metal Glaze/thick Film, 0.1W, 4320000ohm, 75V, 1% +/-Tol, 100ppm/Cel, Surface Mount, 0603; Manufacturer: Vishay; Manufacturer Part Number: CRCW06034M32FKEA; Power: 100mW; Rated Temperature: 70°C; Value: 4.32MR; Temperature Coefficient: 100ppm/°C; Package Height: 0.45mm; Package Length: 1.55mm; Package Width: 0.85mm; Reference Standard: AEC-Q200; Supplier: Digikey; Supplier Part Number: 541-4.32MHCT-ND; RoHS: Yes; Category: Chip SMD Resistors; Stock: 24135; Pricing: 1=0.1, 10=0.026, 50=0.0166, 100=0.0139, 500=0.0095, 1000=0.00821 (USD); Mounting Technology: Surface Mount; Pins: 2; Package Shape: Rectangular; Case/Package: 0603; Terminal Finish: Nickel; Min Operating Temperature: -55°C; Max Operating Temperature: 155°C; Tolerance: 1%; JESD-609 Code: e3; Resistor Type: FIXED RESISTOR; Construction: Chip; Package Style: SMTMeter; Packaging: Tape and Reel; Technology: METAL GLAZE/THICK FILM; Termination: Wraparound; Working Voltage: 75V; Reach SVHC Compliant: Yes; RoHS Compliant: Yes; ComponentLink1URL: https://datasheet.ciiva.com:443/pdfs/VipMasterIC/IC/VISH/VISH-S-A0007266705/VISH-S-A0007266705-1.pdf?src-supplier=IHS+Markit; ComponentLink1Description: https://datasheet.ciiva.com:443/pdfs/VipMasterIC/IC/VISH/VISH-S-A0007266705/VISH-S-A0007266705-1.pdf?src-supplier=IHS+Markit; ComponentLink2URL: https://datasheet.ciiva.com/5540/dcrcwe3-109170-5540878.pdf?src-supplier=Mouser; ComponentLink2Description: https://datasheet.ciiva.com/5540/dcrcwe3-109170-5540878.pdf?src-supplier=Mouser; ComponentLink3URL: https://datasheet.ciiva.com/7843/1697337-7843301.pdf?src-supplier=Element14; ComponentLink3Description: https://datasheet.ciiva.com/7843/1697337-7843301.pdf?src-supplier=Element14; ComponentLink4URL: https://datasheet.ciiva.com/22704/1697337-22704008.pdf?src-supplier=Element14; ComponentLink4Description: https://datasheet.ciiva.com/22704/1697337-22704008.pdf?src-supplier=Element14; ComponentLink5URL: https://datasheet.ciiva.com/16494/dcrcwe3-16494470.pdf?src-supplier=Future+Electronics; ComponentLink5Description: https://datasheet.ciiva.com/16494/dcrcwe3-16494470.pdf?src-supplier=Future+Electronics; ComponentLink6URL: https://datasheet.ciiva.com/9073/dcrcwe3-9073225.pdf?src-supplier=Avnet; ComponentLink6Description: https://datasheet.ciiva.com/9073/dcrcwe3-9073225.pdf?src-supplier=Avnet; ComponentLink7URL: https://datasheet.ciiva.com/2466/dcrcwe3-2466713.pdf?src-supplier=Digikey; ComponentLink7Description: https://datasheet.ciiva.com/2466/dcrcwe3-2466713.pdf?src-supplier=Digikey; ComponentLink8URL: https://datasheet.ciiva.com/2466/dcrcwe3-2466714.pdf?src-supplier=Digikey; ComponentLink8Description: https://datasheet.ciiva.com/2466/dcrcwe3-2466714.pdf?src-supplier=Digikey; ComponentLink9URL: https://datasheet.ciiva.com/2466/dcrcwe3-2466715.pdf?src-supplier=Digikey; ComponentLink9Description: https://datasheet.ciiva.com/2466/dcrcwe3-2466715.pdf?src-supplier=Digikey; ComponentLink10URL: https://datasheet.ciiva.com/3257/dcrcwe3-3257679.pdf?src-supplier=Avnet; ComponentLink10Description: https://datasheet.ciiva.com/3257/dcrcwe3-3257679.pdf?src-supplier=Avnet
R27 = R_820_0603: RES 820OHM 0.1W 0603; Manufacturer: Stackpole Electronics; Manufacturer Part Number: RMCF0603FT820R; Tolerance: 1%; Power: 100mW; Rated Temperature: 70°C; Value: 820R; Temperature Coefficient: 100ppm/°C; Working Voltage: 75V; Package Height: 0.45mm; Package Length: 1.55mm; Package Width: 0.8mm; Reference Standard: AEC-Q200; Supplier: Digikey; Supplier Part Number: RMCF0603FT820RDKR-ND; RoHS: Yes; Category: Chip SMD Resistors; Stock: 449150; Pricing: 1=0.1, 10=0.015, 50=0.009, 100=0.0075, 500=0.00498, 1000=0.00425 (USD); Mounting Technology: Surface Mount; Pins: 2; Package Shape: Rectangular; Case/Package: 0603; Terminal Finish: Nickel; Min Operating Temperature: -55°C; Max Operating Temperature: 155°C; JESD-609 Code: e3; Resistor Type: FIXED RESISTOR; Construction: Rectangular; Package Style: SMTMeter; Packaging: Tape and Reel; Technology: METAL GLAZE/THICK FILM; Termination: Wraparound; Reach SVHC Compliant: Yes; RoHS Compliant: Yes; ComponentLink1URL: https://datasheet.ciiva.com:443/pdfs/VipMasterIC/IC/SEIE/SEIE-S-A0009541969/SEIE-S-A0009541969-1.pdf?src-supplier=IHS+Markit; ComponentLink1Description: https://datasheet.ciiva.com:443/pdfs/VipMasterIC/IC/SEIE/SEIE-S-A0009541969/SEIE-S-A0009541969-1.pdf?src-supplier=IHS+Markit; ComponentLink2URL: https://www.seielect.com/catalog/SEI-RMCF_RMCP.pdf?src-supplier=Avnet; ComponentLink2Description: https://www.seielect.com/catalog/SEI-RMCF_RMCP.pdf?src-supplier=Avnet; ComponentLink3URL: https://www.seielect.com/Catalog/SEI-RMCF_RMCP.pdf?src-supplier=Digikey; ComponentLink3Description: https://www.seielect.com/Catalog/SEI-RMCF_RMCP.pdf?src-supplier=Digikey; ComponentLink4URL: https://www.seielect.com/catalog/SEI-Packaging.pdf?src-supplier=Digikey; ComponentLink4Description: https://www.seielect.com/catalog/SEI-Packaging.pdf?src-supplier=Digikey